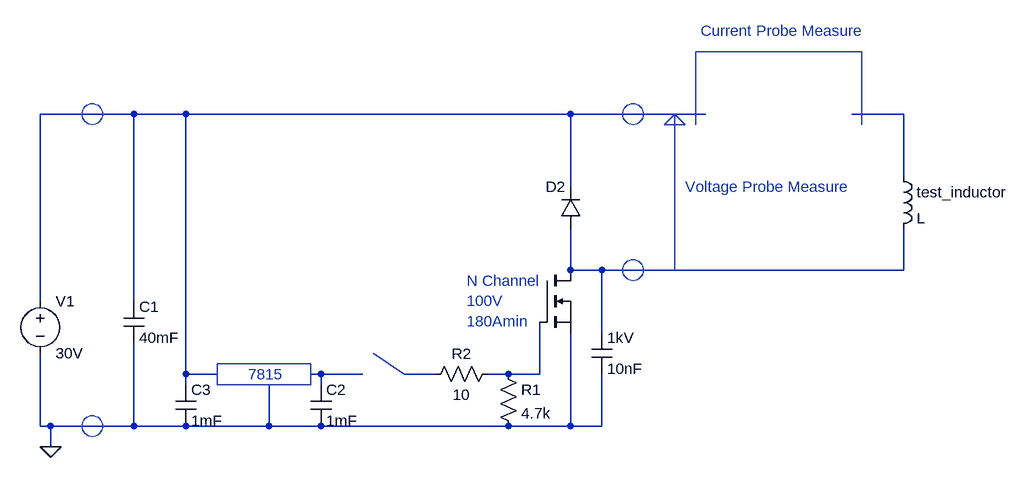
[diagram p0: schematic Circuit_entreprise.asc]
Circuit_entreprise.asc, the LTspice schematic file:
Version 4.1
SHEET 1 1492 680
WIRE 128 -208 -16 -208
WIRE 208 -208 128 -208
WIRE 800 -208 208 -208
WIRE 1008 -208 800 -208
WIRE 1312 -208 1232 -208
WIRE 1312 -112 1312 -208
WIRE 800 -96 800 -208
WIRE 800 32 800 -32
WIRE 848 32 800 32
WIRE 1312 32 1312 -32
WIRE 1312 32 848 32
WIRE -16 80 -16 -208
WIRE 128 80 128 -208
WIRE 848 128 848 32
WIRE 208 192 208 -208
WIRE 256 192 208 192
WIRE 416 192 400 192
WIRE 480 192 416 192
WIRE 592 192 544 192
WIRE 704 192 672 192
WIRE 752 192 752 112
WIRE 752 192 704 192
WIRE 208 208 208 192
WIRE 416 208 416 192
WIRE -16 272 -16 160
WIRE 0 272 -16 272
WIRE 128 272 128 144
WIRE 128 272 0 272
WIRE 208 272 128 272
WIRE 336 272 336 208
WIRE 336 272 208 272
WIRE 416 272 336 272
WIRE 704 272 416 272
WIRE 800 272 800 128
WIRE 800 272 704 272
WIRE 848 272 848 192
WIRE 848 272 800 272
WIRE 0 304 0 272
FLAG 0 304 0
SYMBOL voltage -16 64 R0
SYMATTR InstName V1
SYMATTR Value 30V
SYMBOL cap 112 80 R0
SYMATTR InstName C1
SYMATTR Value 40mF
SYMBOL cap 192 208 R0
SYMATTR InstName C3
SYMATTR Value 1mF
SYMBOL cap 400 208 R0
SYMATTR InstName C2
SYMATTR Value 1mF
SYMBOL res 688 176 R0
SYMATTR InstName R1
SYMATTR Value 4.7k
SYMBOL res 688 176 R90
WINDOW 0 0 56 VBottom 2
WINDOW 3 32 56 VTop 2
SYMATTR InstName R2
SYMATTR Value 10
SYMBOL diode 816 -32 R180
WINDOW 0 24 64 Left 2
WINDOW 3 24 0 Invisible 2
SYMATTR InstName D2
SYMBOL ind 1296 -128 R0
SYMATTR InstName test_inductor
SYMBOL nmos 752 32 R0
WINDOW 0 56 32 Invisible 2
WINDOW 3 56 72 Invisible 2
SYMATTR InstName M1
SYMBOL cap 832 128 R0
SYMATTR InstName 1kV
SYMATTR Value 10nF
TEXT 304 192 Left 2 ;7815
TEXT 1000 -336 Left 2 ;Current Probe Measure
TEXT 640 48 Left 2 ;N Channel\n100V\n180Amin
TEXT 976 -96 Left 2 ;Voltage Probe Measure
LINE Normal 496 160 544 192
LINE Normal 992 -304 992 -192
LINE Normal 1248 -192 1248 -304
LINE Normal 992 -304 1248 -304
LINE Normal 960 -208 960 32
LINE Normal 944 -192 960 -208
LINE Normal 976 -192 944 -192
LINE Normal 960 -208 976 -192
RECTANGLE Normal 400 208 256 176
CIRCLE Normal 912 48 880 16
CIRCLE Normal 912 -192 880 -224
CIRCLE Normal 80 -192 48 -224
CIRCLE Normal 80 288 48 256

The netlist it stands for:
* Circuit_entreprise.asc
V1 N001 0 30V
C1 N001 0 40mF
C3 N001 0 1mF
C2 N004 0 1mF
R1 N006 0 4.7k
R2 N006 N005 10
D2 N003 N001 D
L§test_inductor N002 N003 L
M1 N003 N006 0 0 NMOS
C§1kV N003 0 10nF
.model D D
.lib standard.dio
.model NMOS NMOS
.model PMOS PMOS
.lib standard.mos
* 7815
* Current Probe Measure
* N Channel
* 100V
* 180Amin
* Voltage Probe Measure
.backanno
.end